# Altium schematic sheet POWER.SchDoc: Gimbal Power Schematic
size Letter; Author: Aidan Gratton; DrawnBy: Aidan Gratton; Organization: UW Robotics; Address1: 200 University Avenue; Address2: Waterloo; Address3: Ontario; Address4: Canada N2L 3G6; SheetNumber: 3; SheetTotal: 5
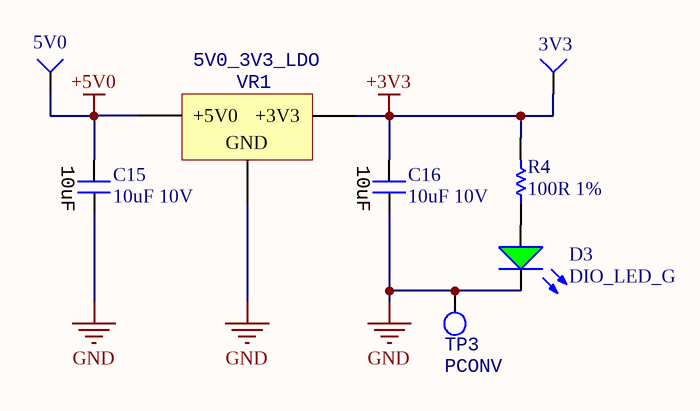
[diagram p0: POWER.SchDoc]

## Parts
C15  10uF 10V  [CAPC0603(1608)55_N]
C16  10uF 10V  [CAPC0603(1608)55_N]
D3  DIO_LED_G  [LED_0805_LINE]
R4  value 100R 1%  [RESC0603(1608)_N]  (hidden comment: RES_100R_0603)
T_3V3  3V3  [TESTPOINT]
TP1  5V0  [TESTPOINT]
TP3  PCONV  [TESTPOINT_LOOP]
VR1  5V0_3V3_LDO  [VOLTAGE_REGULATOR]

## Nets
+3V3: C16.1 R4.2 T_3V3.1(=value) VR1.3(+3V3)
+5V0: C15.1 TP1.1(=value) VR1.1(+5V0)
GND: C15.2 C16.2 D3.2(K) TP3.1 VR1.2(GND)
NetD3_1: D3.1(A) R4.1

## Notes on the sheet
- Title
- Size:
- Date:
- Letter
- Drawn By:
- Sheet
- of
- File:

## Library data of the parts
C15 C16 = CAP_10uF_0603: CAP CER 10UF 10V X5R 0603; MPN: CC0603MRX5R6BB106; Manufacturer: Yageo; Dimensions: 0.063" L x 0.031" W (1.60mm x 0.80mm); Package: 0603 (1608 Metric); Voltage Rating: 10V; Digikey Part Number: 311-1817-1-ND; Value: 10uF
D3 = DIO_LED_G: LED GREEN DIFFUSED 0805 SMD; MPN: LG R971-KN-1; Manufacturer: OSRAM; Forward Voltage Drop: 2.2V; Package: 0805 (2012 Metric); Digikey Part Number: 475-1410-1-ND
R4 = RES_100R_0603: RES SMD 100 OHM 1% 1/10W 0603; Manufacturer: Yageo; MPN: RC0603FR-07100RL; Package: 0603 (1608 Metric); Dimensions: 0.063" L x 0.031" W (1.60mm x 0.80mm); Tolerance: 1%; Digikey Part Number: 311-100HRCT-ND
T_3V3 TP1 = *: TESTPOINT_SMD; Part Number (MPN): *
TP3 = TESTPOINT_LOOP: Loop testpoint through-hole pad
VR1 = 5V0_3V3_LDO: IC REG LINEAR 3.3V 1A DPAK; Part Number: NCP1117DT33T5G; Manufacturer: ON Semiconductor; Current Output: 1A